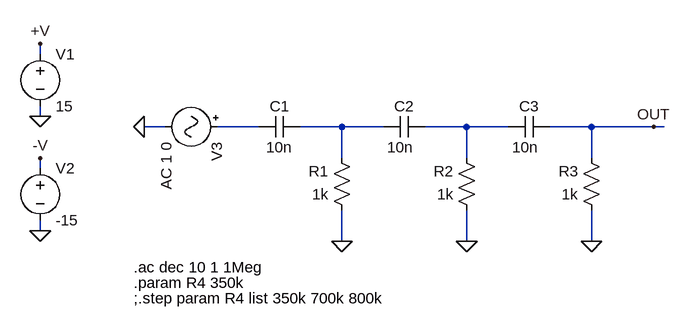
[diagram p0: schematic 06-rc-phase-shift-oscillator-rc.asc]
06-rc-phase-shift-oscillator-rc.asc, the LTspice schematic file:
Version 4.1
SHEET 1 1140 1108
WIRE -720 272 -720 256
WIRE -720 368 -720 352
WIRE -528 384 -560 384
WIRE -384 384 -448 384
WIRE -256 384 -320 384
WIRE -192 384 -256 384
WIRE -64 384 -128 384
WIRE 0 384 -64 384
WIRE 128 384 64 384
WIRE 224 384 128 384
WIRE 240 384 224 384
WIRE -256 432 -256 384
WIRE -64 432 -64 384
WIRE 128 432 128 384
WIRE -720 448 -720 432
WIRE -720 544 -720 528
WIRE -256 560 -256 512
WIRE -64 560 -64 512
WIRE 128 560 128 512
FLAG -720 256 +V
FLAG -720 544 0
FLAG -720 368 0
FLAG -720 432 -V
FLAG -256 560 0
FLAG -64 560 0
FLAG 128 560 0
FLAG -560 384 0
FLAG 224 384 OUT
SYMBOL voltage -720 256 R0
SYMATTR InstName V1
SYMATTR Value 15
SYMBOL voltage -720 432 R0
SYMATTR InstName V2
SYMATTR Value -15
SYMBOL res -240 528 R180
WINDOW 0 36 76 Left 2
WINDOW 3 36 40 Left 2
SYMATTR InstName R1
SYMATTR Value 1k
SYMBOL cap -128 368 R90
WINDOW 0 0 32 VBottom 2
WINDOW 3 32 38 VTop 2
SYMATTR InstName C2
SYMATTR Value 10n
SYMBOL res -48 528 R180
WINDOW 0 36 76 Left 2
WINDOW 3 36 40 Left 2
SYMATTR InstName R2
SYMATTR Value 1k
SYMBOL cap -320 368 R90
WINDOW 0 0 32 VBottom 2
WINDOW 3 32 32 VTop 2
SYMATTR InstName C1
SYMATTR Value 10n
SYMBOL cap 64 368 R90
WINDOW 0 0 32 VBottom 2
WINDOW 3 32 38 VTop 2
SYMATTR InstName C3
SYMATTR Value 10n
SYMBOL res 144 528 R180
WINDOW 0 36 76 Left 2
WINDOW 3 36 40 Left 2
SYMATTR InstName R3
SYMATTR Value 1k
SYMBOL Misc\\signal -432 384 R90
WINDOW 123 24 94 Left 2
WINDOW 39 0 0 Left 0
SYMATTR Value2 AC 1 0
SYMATTR InstName V3
SYMATTR Value ""
TEXT -576 600 Left 2 !.ac dec 10 1 1Meg
TEXT -576 624 Left 2 !.param R4 350k
TEXT -576 648 Left 2 !;.step param R4 list 350k 700k 800k

The netlist it stands for:
* 06-rc-phase-shift-oscillator-rc.asc
V1 +V 0 15
V2 -V 0 -15
R1 0 N002 1k
C2 N003 N002 10n
R2 0 N003 1k
C1 N002 N001 10n
C3 OUT N003 10n
R3 0 OUT 1k
V3 N001 0 AC 1 0
.ac dec 10 1 1Meg
.param R4 350k
;.step param R4 list 350k 700k 800k
.backanno
.end